# EAGLE design Qwiic Mux (EAGLE 7.7.0)
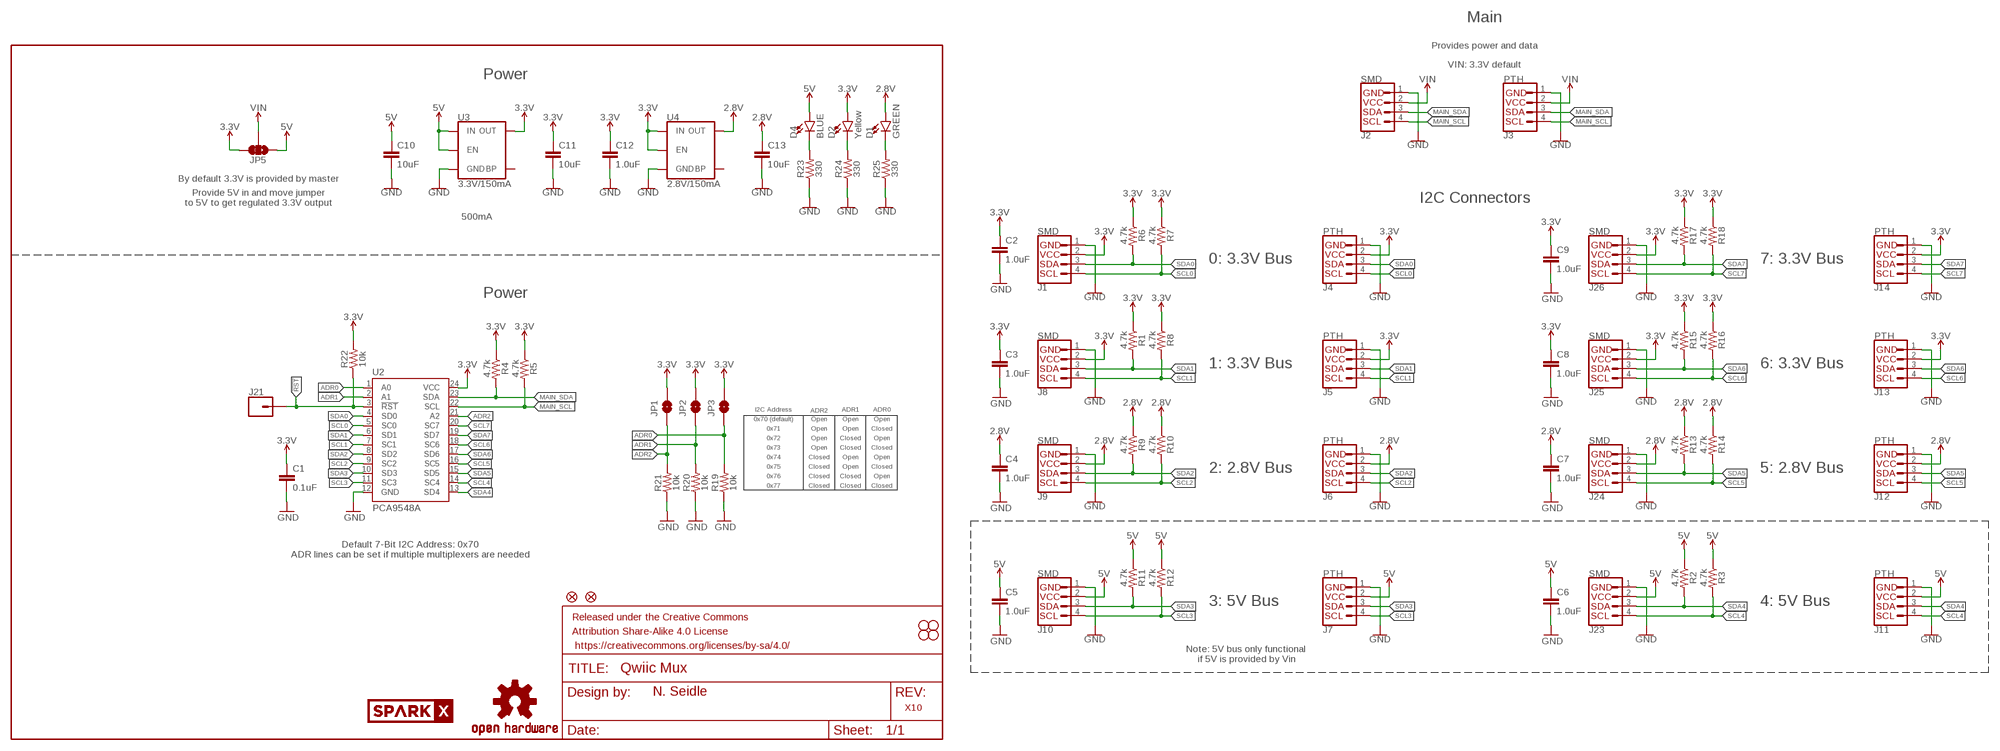
[diagram p0: schematic, sheet 1]

## Parts
C1  0.1uF  0.1UF-0603-25V-(+80/-20%)  [0603]
C2  1.0uF  1.0UF-0603-16V-10%  [0603]
C3  1.0uF  1.0UF-0603-16V-10%  [0603]
C4  1.0uF  1.0UF-0603-16V-10%  [0603]
C5  1.0uF  1.0UF-0603-16V-10%  [0603]
C6  1.0uF  1.0UF-0603-16V-10%  [0603]
C7  1.0uF  1.0UF-0603-16V-10%  [0603]
C8  1.0uF  1.0UF-0603-16V-10%  [0603]
C9  1.0uF  1.0UF-0603-16V-10%  [0603]
C10  10uF  10UF-0603-6.3V-20%  [0603]
C11  10uF  10UF-0603-6.3V-20%  [0603]
C12  1.0uF  1.0UF-0603-16V-10%  [0603]
C13  10uF  10UF-0603-6.3V-20%  [0603]
D1  GREEN  LED-GREEN0603  [LED-0603]
D2  Yellow  LED-YELLOW0603  [LED-0603]
D4  BLUE  LED-BLUE0603  [LED-0603]
FD1  FIDUCIAL1X2  [FIDUCIAL-1X2]
FD2  FIDUCIAL1X2  [FIDUCIAL-1X2]
FRAME1  FRAME-LETTER  [CREATIVE_COMMONS]
H1  STAND-OFF  [STAND-OFF]
H2  STAND-OFF  [STAND-OFF]
H3  STAND-OFF  [STAND-OFF]
H4  STAND-OFF  [STAND-OFF]
J1  SMD  I2C_STANDARDJS-1MM  [1X04_1MM_RA]
J2  SMD  I2C_STANDARDJS-1MM  [1X04_1MM_RA]
J3  PTH  I2C_STANDARD_NO_SILK  [1X04_NO_SILK]
J4  PTH  I2C_STANDARD_NO_SILK  [1X04_NO_SILK]
J5  PTH  I2C_STANDARD_NO_SILK  [1X04_NO_SILK]
J6  PTH  I2C_STANDARD_NO_SILK  [1X04_NO_SILK]
J7  PTH  I2C_STANDARD_NO_SILK  [1X04_NO_SILK]
J8  SMD  I2C_STANDARDJS-1MM  [1X04_1MM_RA]
J9  SMD  I2C_STANDARDJS-1MM  [1X04_1MM_RA]
J10  SMD  I2C_STANDARDJS-1MM  [1X04_1MM_RA]
J11  PTH  I2C_STANDARD_NO_SILK  [1X04_NO_SILK]
J12  PTH  I2C_STANDARD_NO_SILK  [1X04_NO_SILK]
J13  PTH  I2C_STANDARD_NO_SILK  [1X04_NO_SILK]
J14  PTH  I2C_STANDARD_NO_SILK  [1X04_NO_SILK]
J21  CONN_01PTH_NO_SILK_YES_STOP  [1X01_NO_SILK]
J23  SMD  I2C_STANDARDJS-1MM  [1X04_1MM_RA]
J24  SMD  I2C_STANDARDJS-1MM  [1X04_1MM_RA]
J25  SMD  I2C_STANDARDJS-1MM  [1X04_1MM_RA]
J26  SMD  I2C_STANDARDJS-1MM  [1X04_1MM_RA]
JP1  JUMPER-SMT_2_NO_SILK  [SMT-JUMPER_2_NO_SILK]
JP2  JUMPER-SMT_2_NO_SILK  [SMT-JUMPER_2_NO_SILK]
JP3  JUMPER-SMT_2_NO_SILK  [SMT-JUMPER_2_NO_SILK]
JP5  JUMPER-SMT_3_1-NC_TRACE_SILK  [SMT-JUMPER_3_1-NC_TRACE_SILK]
LOGO1  OSHW-LOGOMINI  [OSHW-LOGO-MINI]
R1  4.7k  4.7KOHM-0603-1/10W-1%  [0603]
R2  4.7k  4.7KOHM-0603-1/10W-1%  [0603]
R3  4.7k  4.7KOHM-0603-1/10W-1%  [0603]
R4  4.7k  4.7KOHM-0603-1/10W-1%  [0603]
R5  4.7k  4.7KOHM-0603-1/10W-1%  [0603]
R6  4.7k  4.7KOHM-0603-1/10W-1%  [0603]
R7  4.7k  4.7KOHM-0603-1/10W-1%  [0603]
R8  4.7k  4.7KOHM-0603-1/10W-1%  [0603]
R9  4.7k  4.7KOHM-0603-1/10W-1%  [0603]
R10  4.7k  4.7KOHM-0603-1/10W-1%  [0603]
R11  4.7k  4.7KOHM-0603-1/10W-1%  [0603]
R12  4.7k  4.7KOHM-0603-1/10W-1%  [0603]
R13  4.7k  4.7KOHM-0603-1/10W-1%  [0603]
R14  4.7k  4.7KOHM-0603-1/10W-1%  [0603]
R15  4.7k  4.7KOHM-0603-1/10W-1%  [0603]
R16  4.7k  4.7KOHM-0603-1/10W-1%  [0603]
R17  4.7k  4.7KOHM-0603-1/10W-1%  [0603]
R18  4.7k  4.7KOHM-0603-1/10W-1%  [0603]
R19  10k  10KOHM-0603-1/10W-1%  [0603]
R20  10k  10KOHM-0603-1/10W-1%  [0603]
R21  10k  10KOHM-0603-1/10W-1%  [0603]
R22  10k  10KOHM-0603-1/10W-1%  [0603]
R23  330  330OHM-0603-1/10W-1%  [0603]
R24  330  330OHM-0603-1/10W-1%  [0603]
R25  330  330OHM-0603-1/10W-1%  [0603]
U2  PCA9548A  TCA9548A  [TSSOP28]
U3  3.3V/150mA  V_REG_MIC52053.3V  [SOT23-5]
U4  2.8V/150mA  V_REG_MIC52053.3V  [SOT23-5]
U$1  SPARKX-LOGO3  [SPARKX-SMALL]
U$2  SPARKX-LOGO5  [SPARKX-LARGE]

## Nets
2.8V: C4.1 C7.1 C13.1 D1.A J6.2(VCC) J9.2(VCC) J12.2(VCC) J24.2(VCC) R9.1 R10.1 R13.1 R14.1 U4.5(OUT)
3.3V: C1.1 C2.1 C3.1 C8.1 C9.1 C11.1 C12.1 D2.A J1.2(VCC) J4.2(VCC) J5.2(VCC) J8.2(VCC) J13.2(VCC) J14.2(VCC) J25.2(VCC) J26.2(VCC) JP1.2 JP2.2 JP3.2 JP5.3 R1.1 R4.1 R5.1 R6.1 R7.1 R8.1 R15.1 R16.1 R17.1 R18.1 R22.2 U2.24(VCC) U3.5(OUT) U4.1(IN) U4.3(EN)
5V: C5.1 C6.1 C10.1 D4.A J7.2(VCC) J10.2(VCC) J11.2(VCC) J23.2(VCC) JP5.1 R2.1 R3.1 R11.1 R12.1 U3.1(IN) U3.3(EN)
!RST: J21.1 R22.1 U2.3(!RST)
ADR0: JP3.1 R19.2 U2.1(A0)
ADR1: JP2.1 R20.2 U2.2(A1)
ADR2: JP1.1 R21.2 U2.21(A2)
GND [vcc]: C1.2 C2.2 C3.2 C4.2 C5.2 C6.2 C7.2 C8.2 C9.2 C10.2 C11.2 C12.2 C13.2 J1.1(GND) J2.1(GND) J3.1(GND) J4.1(GND) J5.1(GND) J6.1(GND) J7.1(GND) J8.1(GND) J9.1(GND) J10.1(GND) J11.1(GND) J12.1(GND) J13.1(GND) J14.1(GND) J23.1(GND) J24.1(GND) J25.1(GND) J26.1(GND) R19.1 R20.1 R21.1 R23.1 R24.1 R25.1 U2.12(GND) U3.2(GND) U4.2(GND)
MAIN_SCL: J2.4(SCL) J3.4(SCL) R5.2 U2.22(SCL)
MAIN_SDA: J2.3(SDA) J3.3(SDA) R4.2 U2.23(SDA)
N$1: D2.C R24.2
N$3: D1.C R25.2
N$4: D4.C R23.2
SCL0: J1.4(SCL) J4.4(SCL) R7.2 U2.5(SC0)
SCL1: J5.4(SCL) J8.4(SCL) R8.2 U2.7(SC1)
SCL2: J6.4(SCL) J9.4(SCL) R10.2 U2.9(SC2)
SCL3: J7.4(SCL) J10.4(SCL) R12.2 U2.11(SC3)
SCL4: J11.4(SCL) J23.4(SCL) R3.2 U2.14(SC4)
SCL5: J12.4(SCL) J24.4(SCL) R14.2 U2.16(SC5)
SCL6: J13.4(SCL) J25.4(SCL) R16.2 U2.18(SC6)
SCL7: J14.4(SCL) J26.4(SCL) R18.2 U2.20(SC7)
SDA0: J1.3(SDA) J4.3(SDA) R6.2 U2.4(SD0)
SDA1: J5.3(SDA) J8.3(SDA) R1.2 U2.6(SD1)
SDA2: J6.3(SDA) J9.3(SDA) R9.2 U2.8(SD2)
SDA3: J7.3(SDA) J10.3(SDA) R11.2 U2.10(SD3)
SDA4: J11.3(SDA) J23.3(SDA) R2.2 U2.13(SD4)
SDA5: J12.3(SDA) J24.3(SDA) R13.2 U2.15(SD5)
SDA6: J13.3(SDA) J25.3(SDA) R15.2 U2.17(SD6)
SDA7: J14.3(SDA) J26.3(SDA) R17.2 U2.19(SD7)
VIN: J2.2(VCC) J3.2(VCC) JP5.2
Unconnected: U3.4(BP) U4.4(BP)

## Notes on the sheet
- Main
- Provides power and data
- VIN: 3.3V default
- Power
- By default 3.3V is provided by master
- Provide 5V in and move jumper
  to 5V to get regulated 3.3V output
- I2C Connectors
- 500mA
- 0: 3.3V Bus | 7: 3.3V Bus
- Power
- 1: 3.3V Bus | 6: 3.3V Bus
- I2C Address | ADR2 | ADR1 | ADR0
- 0x70 (default) | Open | Open | Open
- 0x71 | Open | Open | Closed
- 0x72 | Open | Closed | Open
- 0x73 | Open | Closed | Closed
- 0x74 | Closed | Open | Open
- 0x75 | Closed | Open | Closed
- 2: 2.8V Bus | 5: 2.8V Bus
- 0x76 | Closed | Closed | Open
- 0x77 | Closed | Closed | Closed
- Default 7-Bit I2C Address: 0x70
  ADR lines can be set if multiple multiplexers are needed
- 3: 5V Bus | 4: 5V Bus
- Note: 5V bus only functional 
  if 5V is provided by Vin
- N. Seidle
- X10

## Library data of the parts
C1 = SparkFun-Capacitors:0.1UF: 0.1µF ceramic capacitors A capacitor is a passive two-terminal electrical component used to store electrical energy temporarily in an electric field.; PROD_ID: CAP-00810
C2-C9 C12 = SparkFun-Capacitors:1.0UF: 1µF ceramic capacitors A capacitor is a passive two-terminal electrical component used to store electrical energy temporarily in an electric field.; PROD_ID: CAP-00868
C10 C11 C13 = SparkFun-Capacitors:10UF: 10.0µF ceramic capacitors A capacitor is a passive two-terminal electrical component used to store electrical energy temporarily in an electric field.; PROD_ID: CAP-11015
D1 = SparkFun-LED:LED-GREEN: Green SMD LED Used in manufacturing of various products at SparkFun Packages: 0603 - SMD 0603 package [Product Link] <http://www.futureelectronics.com/en/technologies/semiconductors/optoelectronics/leds/Pages/9894312-LTST-C190GKT.aspx?CrossPart=HSMG-C190&IM=0> LilyPad 1206 - SMD1206 LilyPad package [Product Link] <http://www.futureelectronics.com/en/Technologies/Product.aspx?ProductID=IN150NGHARVATEKCORPORATION2049943&IM=0> 1206 - SMD1206 package [Product Link] <http://www.futureelectronics.com/en/technologies/semiconductors/optoelectronics/leds/Pages/8315665-LTST-C150KGKT.aspx?IM=0> 1206 Bottom Mount -SMD 1206 Bottom Mount [Product Link] <http://www.digikey.com/product-detail/en/lite-on-inc/LTST-C230KGKT/160-1456-1-ND/386854> SparkFun Products: Pro Mini 328 -5V <https://www.sparkfun.com/products/821> RedBoard <https://www.sparkfun.com/products/12757> MP3 Trigger <https://www.sparkfun.com/products/13720> Makey Makey <https://www.sparkfun.com/products/11076>; PROD_ID: DIO-00821
D2 = SparkFun-LED:LED-YELLOW: Yellow SMD LED Used in manufacturing several products at SparkFun. Packages: 0603 - SMD 0603 package[Product Link] <http://www.kingbrightusa.com/product.asp?catalog_name=LED&product_id=APT1608SYCK> 0603 -SMART - SMART SMD 0603 package (more efficient/more expensive) [Product Link] <http://www.osram-os.com/osram_os/en/products/product-catalog/led-light-emitting-diodes/smartled-0603/ly-l29k/index.jsp> LilyPad - SMD1206 package[Product Datasheet] <https://www.sparkfun.com/datasheets/DevTools/LilyPad/Q150YUS4.pdf> SparkFun Products: Blynk Board <https://www.sparkfun.com/products/13794> IOIO-OTG <https://www.sparkfun.com/products/13613> XBee Explorer Serial <https://www.sparkfun.com/products/13225>; PROD_ID: DIO-09003
D4 = SparkFun-LED:LED-BLUE: Blue SMD LED Used in manufacturing of various products at SparkFun Packages: 0603 - SMD 0603 package [Product Link] <http://www.digikey.com/product-detail/en/SMLE12BC7TT86/511-1589-2-ND/1641808> 1206 - SMD1206 package [Product Link] <http://www.digikey.com/product-detail/en/lite-on-inc/LTST-C150TBKT/160-1643-1-ND/573584> SparkFun Products: ESP8266 Thing-Dev Board <https://www.sparkfun.com/products/13711> RedBoard <https://www.sparkfun.com/products/12757>; PROD_ID: DIO-08575
FD1 FD2 = SparkFun-Aesthetics:FIDUCIAL: Fiducial Alignment Points Various fiducial points for machine vision alignment.
FRAME1 = SparkFun-Aesthetics:FRAME-LETTER: Schematic Frame Standard 8.5x11 US Letter frame
H1-H4 = SparkFun-Hardware:STAND-OFF: Stand Off Drill holes for mechanically mounting via screws, standoffs, etc. Note: Use the keepout ring to avoid running the screw head into surrounding components. Variant Overviews STAND-OFF - Mechanical footprint for a #4 phillips button head screw. STAND-OFF-TIGHT - Mechanical footprint for a #4 phillips button head screw, Example SparkFun Products Screw - Phillips Head (1/4", 4-40, 10 pack) <https://www.sparkfun.com/products/10453> (PRT-10453) Screw - Phillips Head (1/2", 4-40, 10 pack) <https://www.sparkfun.com/products/10452> (PRT-10452) Screw - Phillips Head (3/4", 4-40, 10 pack) <https://www.sparkfun.com/products/10451> (PRT-10451) Screw - Phillips Head (1", 4-40, 10 pack) <https://www.sparkfun.com/products/10450> (PRT-10450)
J1-J14 J23-J26 = SparkX:I2C_STANDARD: SparkFun I2C Standard Pinout Header SparkFun has standardized on a pinout for all I2C based sensor breakouts. This pinout allows I2C boards to be plugged directly into the headers on Arduino Uno compatible boards, and to be daisy chained easily. Example SparkFun Products: SparkFun Atmospheric Sensor Breakout - BME280 <https://www.sparkfun.com/products/13676> SparkFun Altitude/Pressure Sensor Breakout - MPL3115A2 <https://www.sparkfun.com/products/11084> SparkFun TOF Range Finder Sensor - VL6180 <https://www.sparkfun.com/products/12785>
J21 = SparkFun-Connectors:CONN_01: Single connection point. Often used as Generic Header-pin footprint for 0.1 inch spaced/style header connections On any of the 0.1 inch spaced packages, you can populate with these: Break Away Headers - Straight <https://www.sparkfun.com/products/116> (PRT-00116) Break Away Male Headers - Right Angle <https://www.sparkfun.com/products/553> (PRT-00553) Female Headers <https://www.sparkfun.com/products/115> (PRT-00115) Break Away Headers - Machine Pin <https://www.sparkfun.com/products/117> (PRT-00117) Break Away Female Headers - Swiss Machine Pin <https://www.sparkfun.com/products/743> (PRT-00743) This device is also useful as a general connection point to wire up your design to another part of your project. Our various solder wires solder well into these plated through hole pads. Hook-Up Wire - Assortment (Stranded, 22 AWG) <https://www.sparkfun.com/products/11375> (PRT-11375) Hook-Up Wire - Assortment (Solid Core, 22 AWG) <https://www.sparkfun.com/products/11367> (PRT-11367) View the entire wire category on our website here <https://www.sparkfun.com/categories/141> Special notes: SMTSO-256-ET is a "flush mount" nut for a 4-40 screw. We mostly use this on specialty testbeds; it is a nice way to connect hardware to your PCB at an adjustable hieght. Also note, the SNAP packages are for using a snappable style connector. We sell a baggie of snaps and they are also used on two LilyPad designs: Snap Assortment - 30 pack (male and female) <https://www.sparkfun.com/products/11347> (DEV-11347) LilyPad Arduino SimpleSnap <https://www.sparkfun.com/products/10941> (DEV-10941) LilyPad SimpleSnap Protoboard <https://www.sparkfun.com/products/10940> (DEV-10940)
JP1-JP3 = SparkFun-Jumpers:JUMPER-SMT_2_NO: Normally open jumper This jumper has two pads in close proximity to each other. Apply solder to close the connection. Round pads are easier to solder for beginners, but are a lot larger. SparkFun Product that uses the round pads: SparkFun EL Sequencer <https://www.sparkfun.com/products/12781>
JP5 = SparkFun-Jumpers:JUMPER-SMT_3_1-NC_TRACE: Normally closed trace jumper (1 of 2 connections) This jumper has a trace between two pads so it's normally closed (NC). The other connection is normally open (NO). Use a razor knife to open the connection. For best results follow the IPC guidelines for cutting traces: Cutout at least 0.063 mm (0.005 in). Remove all loose material to clean up the cut area. Seal the cut with an approved epoxy. Reapply solder to reclose the connection, or to close the NO connection.
LOGO1 = SparkFun-Aesthetics:OSHW-LOGO: Open Source Hardware Logo This logo indicates the piece of hardware it is found on incorporates a OSHW license and/or adheres to the definition of open source hardware found here: http://freedomdefined.org/OSHW
R1-R18 = SparkFun-Resistors:4.7KOHM: 4.7kΩ resistor A resistor is a passive two-terminal electrical component that implements electrical resistance as a circuit element. Resistors act to reduce current flow, and, at the same time, act to lower voltage levels within circuits. - Wikipedia; PROD_ID: RES-07857
R19-R22 = SparkFun-Resistors:10KOHM: 10kΩ resistor A resistor is a passive two-terminal electrical component that implements electrical resistance as a circuit element. Resistors act to reduce current flow, and, at the same time, act to lower voltage levels within circuits. - Wikipedia; PROD_ID: RES-00824
R23-R25 = SparkFun-Resistors:330OHM: 330Ω resistor A resistor is a passive two-terminal electrical component that implements electrical resistance as a circuit element. Resistors act to reduce current flow, and, at the same time, act to lower voltage levels within circuits. - Wikipedia; PROD_ID: RES-00818
U2 = SparkX:TCA9548A
U3 = SparkFun-IC-Power:V_REG_MIC5205: V_REG MIC5205 Standard 3.3V, 5V, and Adjustable 150mA LDO voltage regulator in SOT-23 layout. Micrel part MIC5205. BP (by-pass) pin is used to lower output noise with 470pF cap, may be left open. On the adjustable version BP is used to set output.; PROD_ID: VREG-00822
U4 = SparkFun-IC-Power:V_REG_MIC5205: V_REG MIC5205 Standard 3.3V, 5V, and Adjustable 150mA LDO voltage regulator in SOT-23 layout. Micrel part MIC5205. BP (by-pass) pin is used to lower output noise with 470pF cap, may be left open. On the adjustable version BP is used to set output.; PROD_ID: VREG-00822; VALUE: 3.3V/150mA
U$1 U$2 = SparkX:SPARKX-LOGO

## Net classes
0 Default: width 0.178 mm
1 vcc: width 0.178 mm

## Board
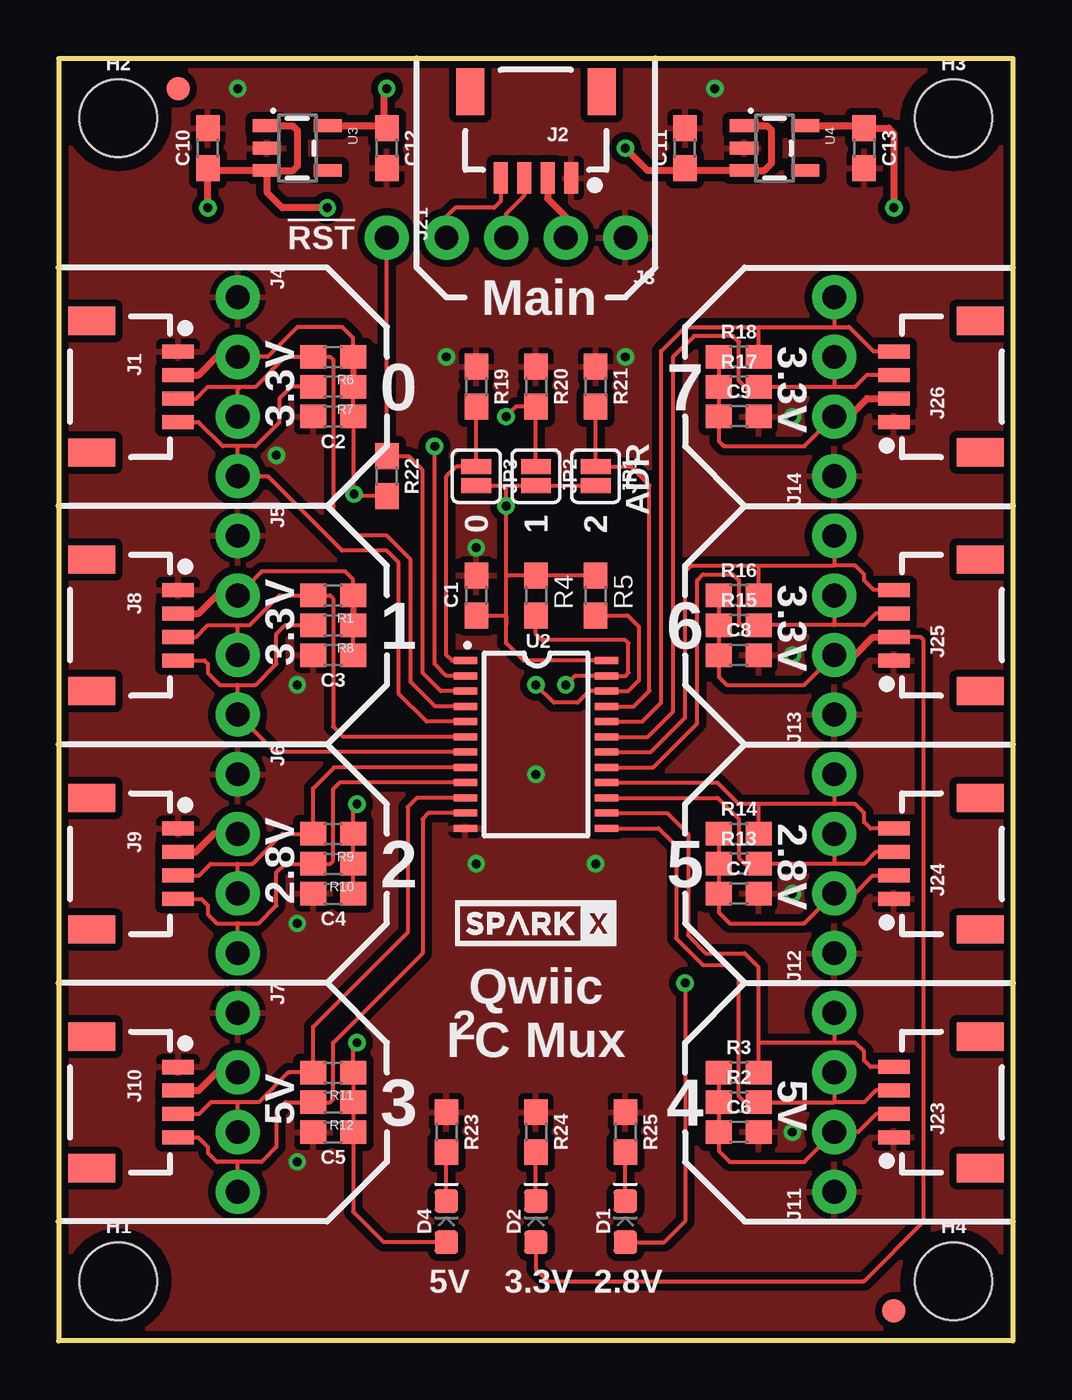
[diagram p1: board, top side]
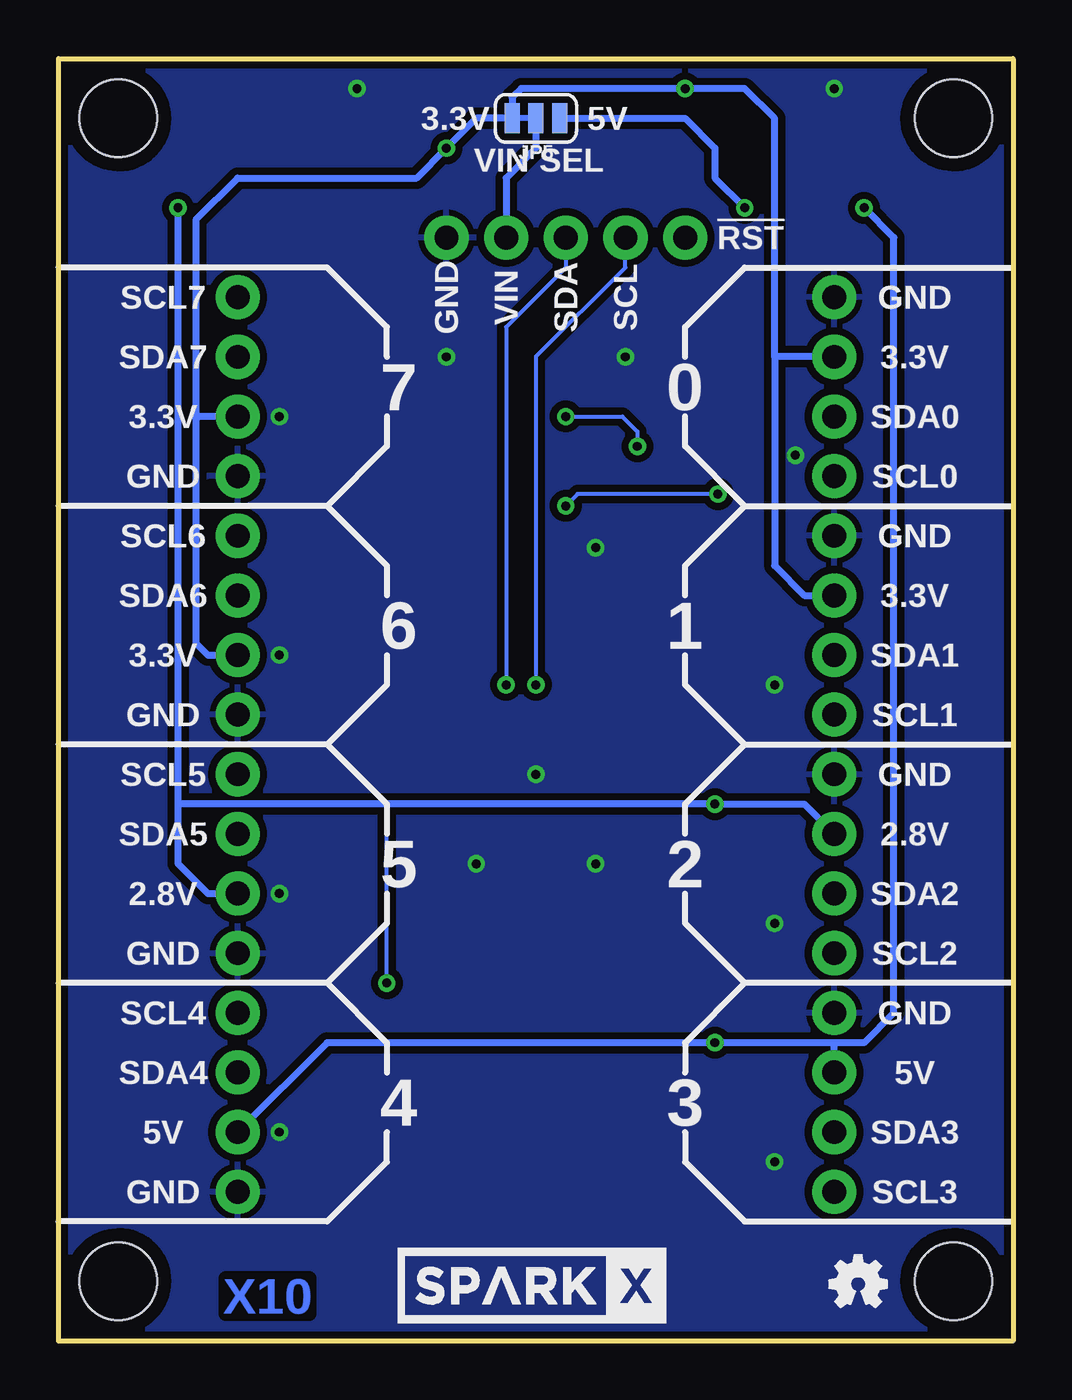
[diagram p2: board, bottom side, seen from below]

Size 40.64 x 54.61 mm. Coordinates in mm from the lower left corner, seen from the top.
Outline: 0,54.61 0,0 40.64,0 40.64,54.61 0,54.61
Copper layers (1*16): Top 0.035mm / dielectric 1.5mm / Bottom 0.035mm
Design rules "SparkFun-2-layer-TIGHT *": minimum track width 7mil, minimum drill 15mil, track to track 6mil, track to pad 6mil, pad to pad 6mil, via to via 6mil, smd to smd 6mil, copper to edge 7mil, drill to drill 7mil, minimum pad ring 7mil, minimum via ring 7mil, stop-mask expansion 4mil, vias tented up to drill 25mil, thermal gap 10mil

### Footprints (pad centres in the part's own frame; a part is rotated, then mirrored left to right if it is on the bottom)
0603 = smd 1.1 x 1: 1 -0.85,0; 2 0.85,0
LED-0603 = smd 1 x 1: A -0.877,0; C 0.877,0
FIDUCIAL-1X2 = smd 1 x 1: 1 0,0
STAND-OFF = hole 3.302: 0,0
1X04_1MM_RA = smd 0.6 x 1.35: 1 -1.5,0; 2 -0.5,0; 3 0.5,0; 4 1.5,0 | smd 1.2 x 2: NC1 2.8,-3.675; NC2 -2.8,-3.675
1X04_NO_SILK = drill 1.016 pad 1.88: 1 0,0; 2 2.54,0; 3 5.08,0; 4 7.62,0
1X01_NO_SILK = drill 1.016 pad 1.88: 1 0,0
SMT-JUMPER_2_NO_SILK = smd 0.635 x 1.27: 1 -0.406,0; 2 0.406,0
SMT-JUMPER_3_1-NC_TRACE_SILK = smd 0.635 x 1.27: 1 -1.016,0; 2 0,0; 3 1.016,0
TSSOP28 = smd 1 x 0.3: 1 -3,3.57; 2 -3,2.925; 3 -3,2.275; 4 -3,1.625; 5 -3,0.975; 6 -3,0.325; 7 -3,-0.325; 8 -3,-0.975; 9 -3,-1.625; 10 -3,-2.275; 11 -3,-2.925; 12 -3,-3.575; 13 3,-3.575; 14 3,-2.925; 15 3,-2.275; 16 3,-1.625; 17 3,-0.975; 18 3,-0.325; 19 3,0.325; 20 3,0.975; 21 3,1.625; 22 3,2.275; 23 3,2.925; 24 3,3.575
SOT23-5 = smd 0.55 x 1.2: 1 -0.95,-1.3; 2 0,-1.3; 3 0.95,-1.3; 4 0.95,1.3; 5 -0.95,1.3

### Placement (x,y rotation side)
C1  17.78,31.75 90 top
C2  11.68,39.37 180 top
C3  11.68,29.21 180 top
C4  11.68,19.05 180 top
C5  11.68,8.89 180 top
C6  28.96,8.89 0 top
C7  28.96,19.05 0 top
C8  28.96,29.21 0 top
C9  28.96,39.37 0 top
C10  6.35,50.8 90 top
C11  26.67,50.8 90 top
C12  13.97,50.8 270 top
C13  34.29,50.8 270 top
D1  24.13,5.08 90 top
D2  20.32,5.08 90 top
D4  16.51,5.08 90 top
FD1  5.08,53.34 180 top
FD2  35.56,1.27 180 top
FRAME1  -8.89,-24.13 0 top  (outside the outline)
H1  2.54,2.54 0 top
H2  2.54,52.07 0 top
H3  38.1,52.07 0 top
H4  38.1,2.54 0 top
J1  5.08,40.64 270 top
J2  20.32,49.53 180 top
J3  24.13,46.99 180 top
J4  7.62,44.45 270 top
J5  7.62,34.29 270 top
J6  7.62,24.13 270 top
J7  7.62,13.97 270 top
J8  5.08,30.48 270 top
J9  5.08,20.32 270 top
J10  5.08,10.16 270 top
J11  33.02,6.35 90 top
J12  33.02,16.51 90 top
J13  33.02,26.67 90 top
J14  33.02,36.83 90 top
J21  13.97,46.99 270 top
J23  35.56,10.16 90 top
J24  35.56,20.32 90 top
J25  35.56,30.48 90 top
J26  35.56,40.64 90 top
JP1  22.86,36.83 270 top
JP2  20.32,36.83 270 top
JP3  17.78,36.83 270 top
JP5  20.32,52.07 180 bottom
LOGO1  6.6,2.43 0 bottom
R1  11.68,31.75 180 top
R2  28.96,10.16 0 top
R3  28.96,11.43 0 top
R4  20.32,31.75 270 top
R5  22.86,31.75 270 top
R6  11.68,41.91 180 top
R7  11.68,40.64 180 top
R8  11.68,30.48 180 top
R9  11.68,21.59 180 top
R10  11.68,20.32 180 top
R11  11.68,11.43 180 top
R12  11.68,10.16 180 top
R13  28.96,20.32 0 top
R14  28.96,21.59 0 top
R15  28.96,30.48 0 top
R16  28.96,31.75 0 top
R17  28.96,40.64 0 top
R18  28.96,41.91 0 top
R19  17.78,40.64 270 top
R20  20.32,40.64 270 top
R21  22.86,40.64 270 top
R22  13.97,36.83 270 top
R23  16.51,8.89 270 top
R24  20.32,8.89 270 top
R25  24.13,8.89 270 top
U2  20.32,25.4 0 top
U3  10.16,50.8 270 top
U4  30.48,50.8 270 top
U$1  20.32,17.78 0 top
U$2  20.49,2.35 0 bottom

### Tracks (layer width: path | path; a pad name or v marks a point on that pad's centre or on a via)
2.8V  (via drill 0.38)
  Top 0.178: C4.1 R10.1 R9.1 12.53,22.69 v12.7,22.86 | C13.1 34.29,51.75 | D1.A 25.79,4.2 26.67,5.08 v26.67,15.24 | C7.1 28.11,18.25 28.57,17.78 31.75,17.78 J12.2 33.91,19.05 34.67,19.81 J24.2 | R14.1 R13.1 C7.1 | C7.1
  Top 0.305: J6.2 6.6,21.59 5.83,20.82 J9.2 | v35.56,48.26 35.56,51.44 35.34,51.65 C13.1 34.19,51.75 U4.5
  Bottom 0.178: v26.67,15.24 26.67,22.86
  Bottom 0.305: 35.56,22.86 35.56,20.32 34.29,19.05 J12.2 | 35.56,22.86 v35.56,48.26 | J6.2 8.89,22.86 v12.7,22.86 26.67,22.86 35.56,22.86
3.3V  (via drill 0.38)
  Top 0.178: JP3.2 19.05,36.42 | 19.05,36.42 JP2.2 JP1.2 | C1.1 19.01,30.9 19.05,30.86 | 19.05,30.86 19.05,32.51 | 19.05,32.51 v19.05,35.56 19.05,36.42 | C3.1 R8.1 | R7.1 C2.1 12.53,36.11 v12.57,36.07 12.66,35.98 R22.2 | R6.1 12.53,42.71 12.06,43.18 10.16,43.18 8.89,41.91 J4.2 | R1.1 12.53,32.42 12.19,32.77 8.64,32.77 J5.2 | J8.2 | R5.1 R4.1 19.14,32.6 19.05,32.51 | U2.24 19.79,28.97 19.05,29.72 19.05,30.48 | 19.05,30.48 19.05,30.86 | 19.05,30.86 19.05,30.48 | 19.05,30.48 | D2.A 20.32,3.05 20.83,2.54 34.29,2.54 36.83,5.08 36.83,29.84 36.7,29.97 J25.2 | J13.2 31.75,27.94 28.45,27.94 28.11,28.28 C8.1 | J14.2 31.75,38.1 28.32,38.1 28.11,38.31 C9.1 | R18.1 R17.1 C9.1 | C9.1 | R16.1 R15.1 C8.1 | C8.1
  Top 0.254: R1.1 R8.1 | R6.1 R7.1
  Top 0.305: J1.2 5.96,41.14 6.73,41.91 J4.2 | J8.2 5.97,30.99 6.73,31.75 J5.2 | U4.1 30.16,51.75 30.35,51.56 30.35,50.16 30.04,49.85 U4.3 26.77,49.85 | 13.87,51.75 13.87,53.24 v13.97,53.34 | U3.5 13.87,51.75 | 13.87,51.75 C12.1 | 26.77,49.85 C11.1 | 26.77,49.85 25.08,49.85 v24.13,50.8 | J26.2 34.42,40.13 33.66,39.37 J14.2 | J13.2 33.91,29.21 34.67,29.97 J25.2
  Bottom 0.178: v12.57,36.07 18.54,36.07 v19.05,35.56
  Bottom 0.305: 10.16,41.91 10.16,33.02 8.89,31.75 J5.2 | J4.2 10.16,41.91 | 10.16,41.91 10.16,52.07 11.43,53.34 v13.97,53.34 20.95,53.34 21.34,52.96 JP5.3 22.86,52.07 v24.13,50.8 25.4,49.53 33.02,49.53 34.8,47.75 34.8,39.24 | 34.8,39.24 34.8,29.72 34.29,29.21 J13.2 | J14.2 34.67,39.37 34.8,39.24
5V  (via drill 0.38)
  Top 0.178: v12.7,12.7 12.53,12.53 R11.1 R12.1 C5.1 12.53,5.5 13.83,4.2 D4.A | R3.1 R2.1 C6.1 | C6.1 | C6.1 28.11,8.09 28.57,7.62 31.75,7.62 J11.2 34.04,8.89 34.81,9.66 J23.2
  Top 0.305: U3.3 9.97,49.85 10.16,50.04 10.16,51.56 9.97,51.75 U3.1 | J10.2 5.96,10.66 6.73,11.43 J7.2 | U3.3 6.45,49.85 C10.1 v6.35,48.26 | v11.43,48.26 9.53,48.26 8.86,48.92 U3.3
  Bottom 0.305: JP5.1 13.97,52.07 12.7,50.8 12.7,49.53 v11.43,48.26 | v6.35,48.26 5.08,46.99 5.08,13.97 6.35,12.7 7.62,12.7 | J11.2 29.21,12.7 v12.7,12.7 7.62,12.7 | J7.2 7.62,12.7
!RST
  Top 0.178: U2.3 16.27,27.67 15.49,28.45 15.49,37.08 14.9,37.68 R22.1 J21.1
ADR0
  Top 0.178: R19.2 JP3.1 16.92,37.24 16.51,36.83 16.51,29.21 16.75,28.97 U2.1
ADR1  (via drill 0.38)
  Top 0.178: JP2.1 R20.2 19.47,39.79 v19.05,39.37 | U2.2 16.51,28.32 16,28.83 v16,38.1
  Bottom 0.178: v19.05,39.37 16.64,39.37 16,38.73 v16,38.1
ADR2
  Top 0.178: R21.2 JP1.1 24.36,37.24 25.15,36.45 25.15,27.69 24.48,27.02 U2.21
GND  (via drill 0.38)
  other vias: 9.27,37.72 10.16,27.94 10.16,17.78 10.16,7.62 17.78,33.78 17.78,20.32 22.86,20.32 16.51,41.91 31.24,8.89 31.24,19.05 31.24,29.21 31.24,39.37 7.62,53.34 27.94,53.34 24.13,41.91 20.32,24.13
  pour Top (isolate 0.305): 0,54.61 40.64,54.61 40.64,0 0,0
  pour Bottom (isolate 0.305): 0,54.61 40.64,54.61 40.64,0 0,0
MAIN_SCL  (via drill 0.38)
  Top 0.178: R5.2 24.22,30.9 24.71,30.4 24.71,28.14 24.64,28.07 24.25,27.67 U2.22 22.59,27.67 22.1,27.18 21.08,27.18 v20.32,27.94 | J2.4 18.82,48.54 18.54,48.26 16.89,48.26 16.51,47.88 J3.4
  Bottom 0.178: v20.32,27.94 20.32,41.91 16.51,45.72 J3.4
MAIN_SDA  (via drill 0.38)
  Top 0.178: R4.2 20.32,30.1 20.57,29.84 24.13,29.84 24.26,29.72 24.26,28.45 24.13,28.32 U2.23 21.97,28.32 v21.59,27.94 | J2.3 19.82,48.78 19.05,48.01 J3.3
  Bottom 0.178: J3.3 19.05,45.72 21.59,43.18 v21.59,27.94
N$1
  Top 0.178: D2.C R24.2
N$3
  Top 0.178: D1.C R25.2
N$4
  Top 0.178: D4.C R23.2
SCL0
  Top 0.178: U2.5 15.66,26.37 14.48,27.56 14.48,33.15 13.97,33.66 12.06,33.66 8.89,36.83 J4.4 7.62,38.1 | R7.2 9.9,40.64 9.4,40.13 9.4,39.12 8.38,38.1 7.62,38.1 | 7.62,38.1 6.99,38.1 5.95,39.14 J1.4
SCL1
  Top 0.178: J8.4 6.2,28.98 6.35,28.83 6.35,28.45 6.86,27.94 7.62,27.94 | 7.62,27.94 8.38,27.94 9.27,28.83 9.27,30.1 9.65,30.48 R8.2 | 7.62,27.94 J5.4 9.22,25.07 U2.7
SCL2
  Top 0.178: U2.9 11.96,23.77 11.68,23.5 11.68,20.45 11.56,20.32 R10.2 9.65,20.32 9.27,19.94 9.27,18.54 8.51,17.78 7.62,17.78 | J9.4 6.07,18.82 6.35,18.54 6.35,18.16 6.73,17.78 7.62,17.78 | J6.4 7.62,17.78
SCL3
  Top 0.178: U2.11 15.74,22.47 15.49,22.22 15.49,16.51 11.68,12.7 11.68,10.29 11.56,10.16 R12.2 9.65,10.16 9.27,9.78 9.27,8.26 8.64,7.62 7.62,7.62 | 7.62,7.62 6.73,7.62 6.35,8 6.35,8.26 5.95,8.66 J10.4 | J7.4 7.62,7.62
SCL4
  Top 0.178: U2.14 25.91,22.47 26.8,21.59 26.8,17.27 27.56,16.51 29.21,16.51 29.81,15.91 29.81,12.7 | J23.4 34.57,11.66 34.29,11.94 34.29,12.32 33.91,12.7 33.02,12.7 | J11.4 33.02,12.7 | R3.2 29.81,12.7 | 33.02,12.7 29.81,12.7
SCL5
  Top 0.178: J24.4 34.57,21.82 34.29,22.1 34.29,22.48 33.91,22.86 33.02,22.86 | 33.02,22.86 29.84,22.86 | 29.84,22.86 28.96,22.86 28.04,23.77 U2.16 | J12.4 33.02,22.86 | R14.2 29.81,22.82 29.84,22.86
SCL6
  Top 0.178: J25.4 34.7,31.98 34.29,32.38 34.29,32.64 33.91,33.02 33.02,33.02 | J13.4 33.02,33.02 | U2.18 25.2,25.07 26.67,26.54 26.67,32.77 26.92,33.02 29.84,33.02 | 29.84,33.02 33.02,33.02 | R16.2 29.81,32.98 29.84,33.02
SCL7
  Top 0.178: U2.20 24.85,26.37 25.65,27.18 25.65,42.16 26.67,43.18 29.84,43.18 | 33.02,43.18 33.66,43.18 34.7,42.14 J26.4 | J14.4 33.02,43.18 | 29.84,43.18 33.02,43.18 | R18.2 29.81,43.14 29.84,43.18
SDA0
  Top 0.178: U2.4 16.03,27.02 14.99,28.07 14.99,33.27 13.97,34.29 12.7,34.29 11.68,35.31 11.68,41.78 11.56,41.91 R6.2 | 11.18,41.91 R6.2 | J1.3 5.85,40.14 6.35,40.64 7.75,40.64 | 7.75,40.64 8.38,40.64 9.65,41.91 R6.2 | J4.3 7.62,40.51 7.75,40.64
SDA1
  Top 0.178: U2.6 12.12,25.72 11.68,26.16 11.68,31.62 11.56,31.75 R1.2 9.4,31.75 8.13,30.48 7.62,30.48 | J8.3 5.85,29.98 6.35,30.48 7.62,30.48 | J5.3 7.62,30.48
SDA2
  Top 0.178: U2.8 11.72,24.42 10.83,23.53 R9.2 9.53,21.59 8.26,20.32 7.62,20.32 | J9.3 5.98,19.82 6.48,20.32 7.62,20.32 | J6.3 7.62,20.32
SDA3
  Top 0.178: U2.10 15.25,23.12 14.86,22.73 14.86,17.4 10.83,13.37 R11.2 9.78,11.43 8.51,10.16 7.62,10.16 | 7.62,10.16 6.48,10.16 5.98,9.66 J10.3 | J7.3 7.62,10.16
SDA4
  Top 0.178: U2.13 25.55,21.82 26.29,21.08 26.29,17.14 27.43,16 28.45,16 28.96,15.49 28.96,10.41 29.21,10.16 R2.2 33.02,10.16 | J23.3 34.79,10.66 34.29,10.16 33.02,10.16 | J11.3 33.02,10.16
SDA5
  Top 0.178: J24.3 34.79,20.82 34.29,20.32 33.02,20.32 | 33.02,20.32 R13.2 29.21,20.32 28.96,20.57 28.96,22.23 28.06,23.12 U2.15 | J12.3 33.02,20.32
SDA6
  Top 0.178: J25.3 34.79,30.98 34.29,30.48 33.02,30.48 | 33.02,30.48 R15.2 29.08,30.48 28.96,30.61 28.96,32.38 28.7,32.64 27.43,32.64 27.18,32.38 27.18,26.29 25.31,24.42 U2.17 | J13.3 33.02,30.48
SDA7
  Top 0.178: 33.02,40.64 33.91,40.64 34.41,41.14 J26.3 | J14.3 33.02,40.64 | U2.19 25.09,25.72 26.16,26.8 26.16,41.91 27.05,42.8 28.7,42.8 28.96,42.55 28.96,40.89 29.21,40.64 R17.2 33.02,40.64
VIN
  Top 0.305: J2.2 20.82,48.65 21.59,47.88 J3.2
  Bottom 0.305: JP5.2 20.32,50.8 21.59,49.53 J3.2

### Text on the board
Bottom: X10
tPlace: !RST | Main | 3.3V | 0 | 7 | 3.3V | ADR | 0 | 1 | 2 | 3.3V | 1 | 6 | 3.3V | 2.8V | 2 | 5 | 2.8V | Qwiic / I C Mux | 2 | 5V | 3 | 4 | 5V | 5V | 3.3V | 2.8V
bPlace: 5V | 3.3V | VIN SEL | !RST | GND | SCL | SDA | VIN | GND | SCL7 | 3.3V | SDA7 | 0 | 7 | SDA0 | 3.3V | SCL0 | GND | GND | SCL6 | 3.3V | SDA6 | 1 | 6 | SDA1 | 3.3V | SCL1 | GND | GND | SCL5 | 2.8V | SDA5 | 2 | 5 | SDA2 | 2.8V | SCL2 | GND | GND | SCL4 | 5V | SDA4 | 3 | 4 | SDA3 | 5V | SCL3 | GND
tDocu: N. Seidle